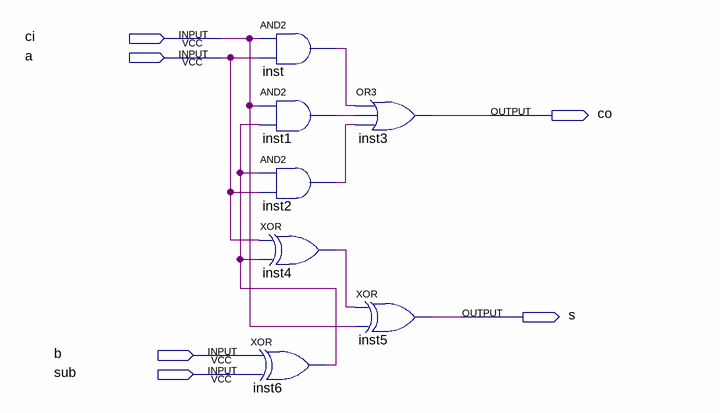
[diagram p0: schematic sheet]
// Quartus schematic jjdy.bdf as structural Verilog: 7 symbols, 6 pins
module jjdy (
  input  ci,
  input  a,
  input  b,
  input  sub,
  output co,
  output s
);

  wire inst1_out, inst2_out, inst4_out, inst6_out, inst_out;

  and inst (inst_out, ci, a);
  and inst1 (inst1_out, ci, inst6_out);
  and inst2 (inst2_out, inst6_out, a);
  xor inst4 (inst4_out, a, inst6_out);
  xor inst6 (inst6_out, b, sub);
  or inst3 (co, inst_out, inst1_out, inst2_out);
  xor inst5 (s, inst4_out, ci);
endmodule
